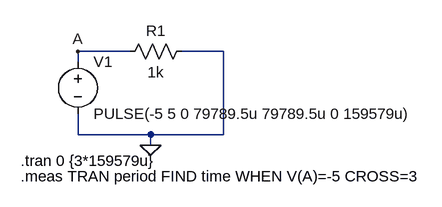
[diagram p0: schematic 2c.asc]
2c.asc, the LTspice schematic file:
Version 4
SHEET 1 988 680
WIRE 192 64 112 64
WIRE 336 64 272 64
WIRE 112 80 112 64
WIRE 112 192 112 160
WIRE 224 192 112 192
WIRE 336 192 336 64
WIRE 336 192 224 192
WIRE 224 208 224 192
FLAG 224 208 0
FLAG 112 64 A
SYMBOL voltage 112 64 R0
WINDOW 123 0 0 Left 0
WINDOW 39 0 0 Left 0
SYMATTR InstName V1
SYMATTR Value PULSE(-5 5 0 79789.5u 79789.5u 0 159579u)
SYMBOL res 288 48 R90
WINDOW 0 0 56 VBottom 2
WINDOW 3 32 56 VTop 2
SYMATTR InstName R1
SYMATTR Value 1k
TEXT 24 232 Left 2 !.tran 0 {3*159579u}
TEXT 24 256 Left 2 !.meas TRAN period FIND time WHEN V(A)=-5 CROSS=3

The netlist it stands for:
* 2c.asc
V1 A 0 PULSE(-5 5 0 79789.5u 79789.5u 0 159579u)
R1 0 A 1k
.tran 0 {3*159579u}
.meas TRAN period FIND time WHEN V(A)=-5 CROSS=3
.backanno
.end

* Results of the author's LTspice run, read from the files saved beside the schematic
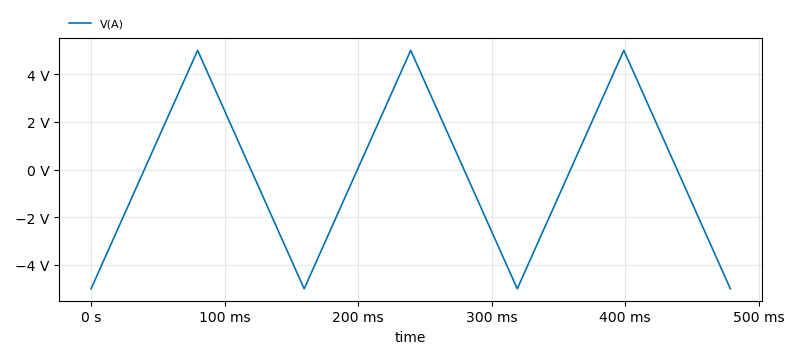
[diagram p1: Transient Analysis of 2c.asc, plotted from the saved traces]
* Transient Analysis, 1 run:
*   V(A): min -5 V, max 5 V, average 5.146 µV, rms 4.57 V, last -5 V
* From the log:
*   period: time=0.159579 at 0.159579